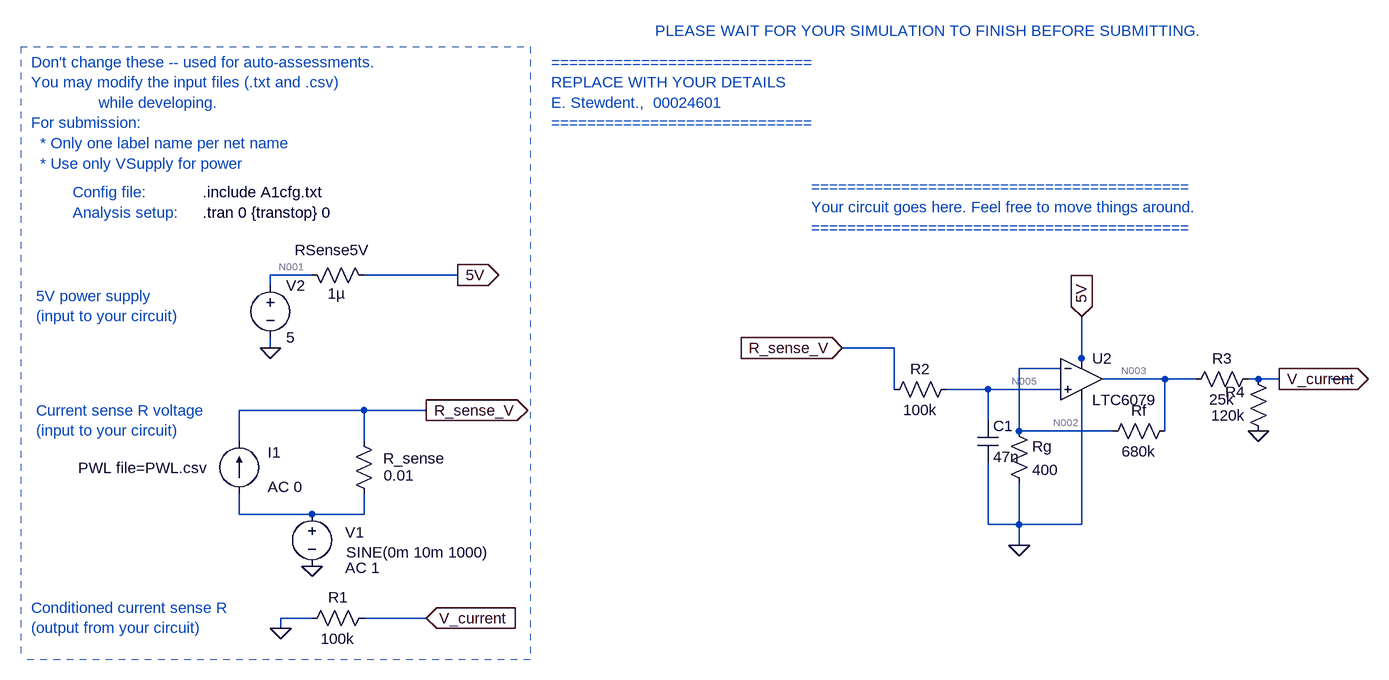
[diagram p0: schematic E344_23648074_A1.asc]
E344_23648074_A1.asc, the LTspice schematic file:
Version 4
SHEET 1 3140 2124
WIRE -1920 -1072 -1984 -1072
WIRE -1696 -1072 -1840 -1072
WIRE -1984 -1056 -1984 -1072
WIRE -1984 -960 -1984 -976
WIRE -1024 -960 -1104 -960
WIRE -736 -944 -736 -1008
WIRE -768 -928 -832 -928
WIRE -736 -928 -736 -944
WIRE -608 -912 -704 -912
WIRE -560 -912 -608 -912
WIRE -464 -912 -480 -912
WIRE -432 -912 -464 -912
WIRE -320 -912 -352 -912
WIRE -1024 -896 -1024 -960
WIRE -880 -896 -944 -896
WIRE -768 -896 -880 -896
WIRE -1840 -864 -2032 -864
WIRE -1744 -864 -1840 -864
WIRE -880 -848 -880 -896
WIRE -832 -832 -832 -928
WIRE -688 -832 -832 -832
WIRE -608 -832 -608 -912
WIRE -2032 -816 -2032 -864
WIRE -1840 -816 -1840 -864
WIRE -2032 -704 -2032 -736
WIRE -1920 -704 -2032 -704
WIRE -1840 -704 -1840 -736
WIRE -1840 -704 -1920 -704
WIRE -880 -688 -880 -784
WIRE -832 -688 -832 -752
WIRE -832 -688 -880 -688
WIRE -736 -688 -736 -880
WIRE -736 -688 -832 -688
WIRE -832 -656 -832 -688
WIRE -1920 -544 -1968 -544
WIRE -1744 -544 -1840 -544
WIRE -1968 -528 -1968 -544
FLAG -1696 -1072 5V
IOPIN -1696 -1072 Out
FLAG -1984 -960 0
FLAG -736 -1008 5V
IOPIN -736 -1008 In
FLAG -1744 -864 R_sense_V
IOPIN -1744 -864 Out
FLAG -1920 -624 0
FLAG -432 -912 V_current
IOPIN -432 -912 Out
FLAG -1104 -960 R_sense_V
IOPIN -1104 -960 In
FLAG -1744 -544 V_current
IOPIN -1744 -544 In
FLAG -1968 -528 0
FLAG -832 -656 0
FLAG -464 -832 0
SYMBOL voltage -1984 -1072 R0
WINDOW 123 0 0 Left 0
WINDOW 39 0 0 Left 0
SYMATTR InstName V2
SYMATTR Value 5
SYMBOL res -1936 -1088 M90
WINDOW 0 -7 47 VBottom 2
WINDOW 3 29 54 VTop 2
SYMATTR InstName RSense5V
SYMATTR Value 1µ
SYMBOL res -1824 -720 R180
WINDOW 0 -109 70 Left 2
WINDOW 3 -62 44 Left 2
SYMATTR InstName R_sense
SYMATTR Value 0.01
SYMBOL current -2032 -736 R180
WINDOW 0 -64 63 Left 2
WINDOW 3 248 39 Right 2
WINDOW 123 -97 10 Left 2
WINDOW 39 0 0 Left 0
SYMATTR InstName I1
SYMATTR Value PWL file=PWL.csv
SYMATTR Value2 AC 0
SYMBOL voltage -1920 -720 R0
WINDOW 0 66 60 Bottom 2
WINDOW 3 163 59 Top 2
WINDOW 123 78 114 Bottom 2
WINDOW 39 0 0 Left 0
SYMATTR InstName V1
SYMATTR Value SINE(0m 10m 1000)
SYMATTR Value2 AC 1
SYMBOL res -1824 -560 R90
WINDOW 0 0 56 VBottom 2
WINDOW 3 32 56 VTop 2
SYMATTR InstName R1
SYMATTR Value 100k
SYMBOL OpAmps\\LTC6079 -736 -912 R0
SYMATTR InstName U2
SYMBOL res -848 -848 R0
SYMATTR InstName Rg
SYMATTR Value 400
SYMBOL res -592 -848 R90
WINDOW 0 0 56 VBottom 2
WINDOW 3 32 56 VTop 2
SYMATTR InstName Rf
SYMATTR Value 680k
SYMBOL res -928 -912 R90
WINDOW 0 0 56 VBottom 2
WINDOW 3 32 56 VTop 2
SYMATTR InstName R2
SYMATTR Value 100k
SYMBOL cap -896 -848 R0
SYMATTR InstName C1
SYMATTR Value 47n
SYMBOL res -464 -928 R90
WINDOW 0 0 56 VBottom 2
WINDOW 3 32 56 VTop 2
SYMATTR InstName R3
SYMATTR Value 25k
SYMBOL res -448 -816 R180
WINDOW 0 36 76 Left 2
WINDOW 3 36 40 Left 2
SYMATTR InstName R4
SYMATTR Value 120k
TEXT -2088 -1168 Left 2 !.tran 0 {transtop} 0
TEXT -2088 -1200 Left 2 !.include A1cfg.txt
TEXT -2352 -1400 Left 2 ;Don't change these -- used for auto-assessments.\nYou may modify the input files (.txt and .csv) \n               while developing.\nFor submission: \n  * Only one label name per net name\n  * Use only VSupply for power
TEXT -2288 -1200 Left 2 ;Config file:
TEXT -2288 -1168 Left 2 ;Analysis setup:
TEXT -1552 -1400 Left 2 ;=============================\nREPLACE WITH YOUR DETAILS\nE. Stewdent.,  00024601\n=============================
TEXT -1152 -1208 Left 2 ;==========================================\nYour circuit goes here. Feel free to move things around. \n==========================================
TEXT -1392 -1448 Left 2 ;PLEASE WAIT FOR YOUR SIMULATION TO FINISH BEFORE SUBMITTING.
TEXT -2344 -1040 Left 2 ;5V power supply\n(input to your circuit)
TEXT -2344 -864 Left 2 ;Current sense R voltage\n(input to your circuit)
TEXT -2352 -560 Left 2 ;Conditioned current sense R\n(output from your circuit)
LINE Normal -1584 -1424 -1584 -480 2
LINE Normal -2368 -1424 -1584 -1424 2
LINE Normal -1584 -480 -2368 -480 2
LINE Normal -1584 -496 -1584 -496 2
LINE Normal -2368 -1424 -2368 -480 2

The netlist it stands for:
* E344_23648074_A1.asc
V2 N001 0 5
RSense5V N001 5V 1µ
R_sense N006 R_sense_V 0.01
I1 N006 R_sense_V PWL file=PWL.csv AC 0
V1 N006 0 SINE(0m 10m 1000) AC 1
R1 V_current 0 100k
XU2 N005 N002 5V 0 N003 LTC6078  ; LTC6079, pins In+ In- V+ V- OUT
Rg N002 0 400
Rf N003 N002 680k
R2 N005 R_sense_V 100k
C1 N005 0 47n
R3 V_current N003 25k
R4 0 V_current 120k
.tran 0 {transtop} 0
.include A1cfg.txt
* Don't change these -- used for auto-assessments.
* You may modify the input files (.txt and .csv)
*                while developing.
* For submission:
*   * Only one label name per net name
*   * Use only VSupply for power
* Config file:
* Analysis setup:
* =============================
* REPLACE WITH YOUR DETAILS
* E. Stewdent.,  00024601
* =============================
* ==========================================
* Your circuit goes here. Feel free to move things around.
* ==========================================
* PLEASE WAIT FOR YOUR SIMULATION TO FINISH BEFORE SUBMITTING.
* 5V power supply
* (input to your circuit)
* Current sense R voltage
* (input to your circuit)
* Conditioned current sense R
* (output from your circuit)
.lib LTC5.lib
.backanno
.end

* Results of the author's LTspice run, read from the files saved beside the schematic
* Operating Point, zero values left out:
*   V(n001) = 5 V
*   V(5v) = 5 V
*   V(v_current) = 1.255 mV
*   V(n005) = 171 nV
*   V(n002) = 1.076 µV
*   V(n003) = 1.83 mV
*   I(R4) = -10.45 nA
*   I(R3) = -23 nA
*   I(R2) = 1.71 pA
*   I(Rf) = 2.689 nA
*   I(Rg) = 2.691 nA
*   I(R1) = 12.55 nA
*   I(R_sense) = -1.71 pA
*   I(Rsense5v) = 37.84 µA
*   I(V1) = 1.71 pA
*   I(V2) = -37.84 µA
*   Ix(u2:1) = -1.71 pA
*   Ix(u2:2) = -1.71 pA
*   Ix(u2:3) = 37.83 µA
*   Ix(u2:4) = -37.81 µA
*   Ix(u2:5) = -25.68 nA
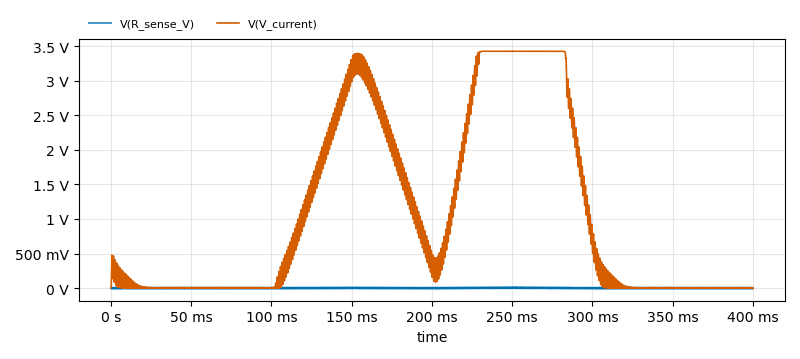
[diagram p1: Transient Analysis of E344_23648074_A1.asc, plotted from the saved traces]
* Transient Analysis, 1 run:
*   V(R_sense_V): min -9.975 mV, max 15.94 mV, average 1.12 mV, rms 7.295 mV, last 0 V
*   V(V_current): min 82.19 µV, max 3.426 V, average 1.098 V, rms 1.731 V, last 173.8 µV